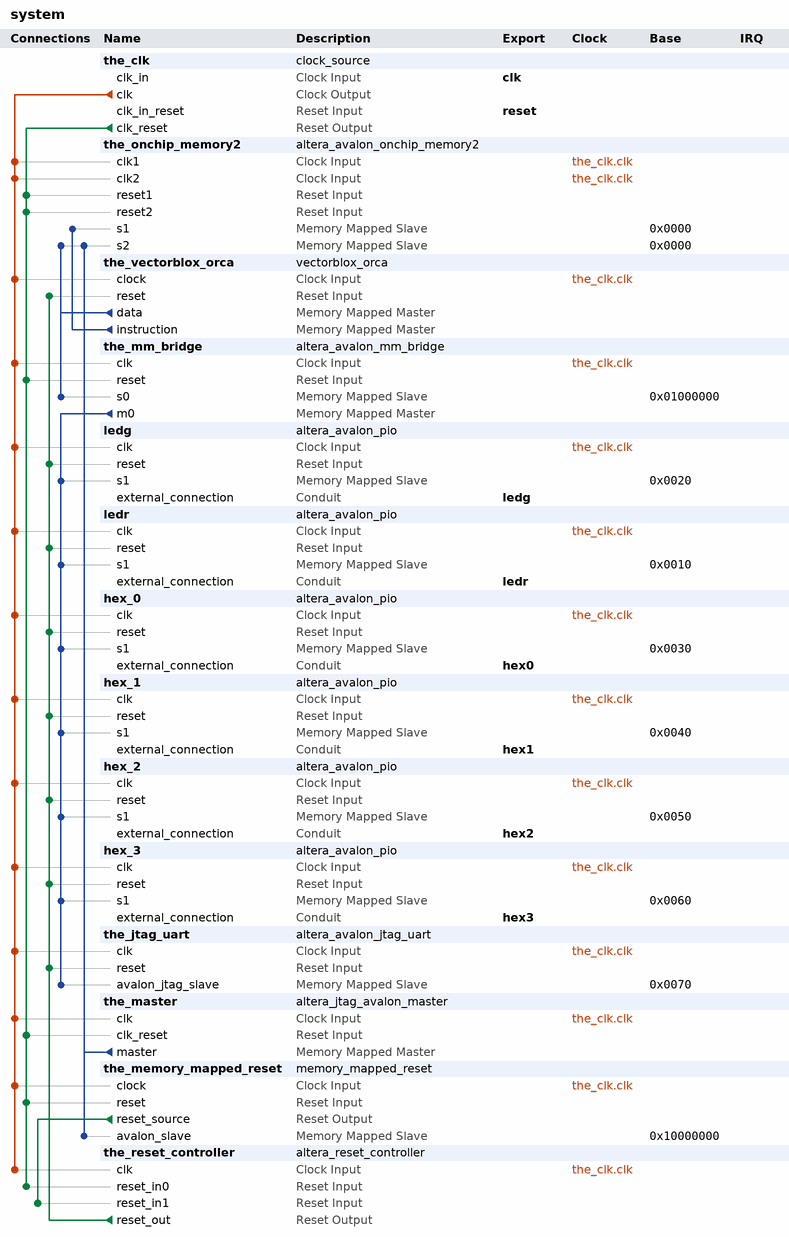
[diagram p0: system contents]
# Platform Designer (Qsys) system system, Cyclone IV E EP4CE115F29C7
# Parameters at their usual value, and those the tool derives, are not listed.
package require -exact qsys 15.1
create_system system
set_project_property DEVICE_FAMILY {Cyclone IV E}
set_project_property DEVICE EP4CE115F29C7

add_instance the_clk clock_source 15.1
set_instance_parameter_value the_clk clockFrequency 50000000

add_instance the_onchip_memory2 altera_avalon_onchip_memory2 15.1
set_instance_parameter_value the_onchip_memory2 dataWidth 32
set_instance_parameter_value the_onchip_memory2 dualPort true
set_instance_parameter_value the_onchip_memory2 initMemContent true
set_instance_parameter_value the_onchip_memory2 initializationFileName test.hex
set_instance_parameter_value the_onchip_memory2 memorySize 65536
set_instance_parameter_value the_onchip_memory2 useNonDefaultInitFile true

add_instance the_vectorblox_orca vectorblox_orca 1.0
set_instance_parameter_value the_vectorblox_orca BRANCH_PREDICTION false
set_instance_parameter_value the_vectorblox_orca BTB_SIZE 0
set_instance_parameter_value the_vectorblox_orca BUS_TYPE Avalon
set_instance_parameter_value the_vectorblox_orca COUNTER_LENGTH 64
set_instance_parameter_value the_vectorblox_orca DATA_REQUEST_REGISTER 0
set_instance_parameter_value the_vectorblox_orca DATA_RETURN_REGISTER 0
set_instance_parameter_value the_vectorblox_orca DIVIDE_ENABLE 1
set_instance_parameter_value the_vectorblox_orca ENABLE_EXCEPTIONS 1
set_instance_parameter_value the_vectorblox_orca ENABLE_EXT_INTERRUPTS 1
set_instance_parameter_value the_vectorblox_orca EXT_INTERRUPTS 1
set_instance_parameter_value the_vectorblox_orca FAMILY ALTERA
set_instance_parameter_value the_vectorblox_orca ICACHE_BURST_EN 0
set_instance_parameter_value the_vectorblox_orca ICACHE_EXTERNAL_WIDTH 32
set_instance_parameter_value the_vectorblox_orca ICACHE_LINE_SIZE 32
set_instance_parameter_value the_vectorblox_orca ICACHE_SIZE 0
set_instance_parameter_value the_vectorblox_orca INTERRUPT_VECTOR 512
set_instance_parameter_value the_vectorblox_orca IUC_ADDR_BASE 0
set_instance_parameter_value the_vectorblox_orca IUC_ADDR_LAST 0
set_instance_parameter_value the_vectorblox_orca LVE_ENABLE 0
set_instance_parameter_value the_vectorblox_orca MULTIPLY_ENABLE 1
set_instance_parameter_value the_vectorblox_orca PIPELINE_STAGES 5
set_instance_parameter_value the_vectorblox_orca POWER_OPTIMIZED 0
set_instance_parameter_value the_vectorblox_orca REGISTER_SIZE 32
set_instance_parameter_value the_vectorblox_orca RESET_VECTOR 0
set_instance_parameter_value the_vectorblox_orca SCRATCHPAD_SIZE 64
set_instance_parameter_value the_vectorblox_orca SHIFTER_MAX_CYCLES 1

add_instance the_mm_bridge altera_avalon_mm_bridge 15.1
set_instance_parameter_value the_mm_bridge ADDRESS_UNITS SYMBOLS
set_instance_parameter_value the_mm_bridge ADDRESS_WIDTH 11
set_instance_parameter_value the_mm_bridge DATA_WIDTH 32
set_instance_parameter_value the_mm_bridge MAX_PENDING_RESPONSES 1
set_instance_parameter_value the_mm_bridge PIPELINE_COMMAND 0
set_instance_parameter_value the_mm_bridge PIPELINE_RESPONSE 0
set_instance_parameter_value the_mm_bridge USE_AUTO_ADDRESS_WIDTH 1

add_instance ledg altera_avalon_pio 15.1
set_instance_parameter_value ledg direction Output
set_instance_parameter_value ledg width 32

add_instance ledr altera_avalon_pio 15.1
set_instance_parameter_value ledr direction Output
set_instance_parameter_value ledr width 32

add_instance hex_0 altera_avalon_pio 15.1
set_instance_parameter_value hex_0 direction Output
set_instance_parameter_value hex_0 width 32

add_instance hex_1 altera_avalon_pio 15.1
set_instance_parameter_value hex_1 direction Output
set_instance_parameter_value hex_1 width 32

add_instance hex_2 altera_avalon_pio 15.1
set_instance_parameter_value hex_2 direction Output
set_instance_parameter_value hex_2 width 32

add_instance hex_3 altera_avalon_pio 15.1
set_instance_parameter_value hex_3 direction Output
set_instance_parameter_value hex_3 width 32

add_instance the_jtag_uart altera_avalon_jtag_uart 15.1
set_instance_parameter_value the_jtag_uart simInteractiveOptions NO_INTERACTIVE_WINDOWS

add_instance the_master altera_jtag_avalon_master 15.1

add_instance the_memory_mapped_reset memory_mapped_reset 1.0
set_instance_parameter_value the_memory_mapped_reset ADDR_WIDTH 2
set_instance_parameter_value the_memory_mapped_reset REGISTER_SIZE 32

add_instance the_reset_controller altera_reset_controller 15.1
set_instance_parameter_value the_reset_controller NUM_RESET_INPUTS 2
set_instance_parameter_value the_reset_controller SYNC_DEPTH 2

# connections
add_connection the_clk.clk hex_0.clk clock
add_connection the_clk.clk hex_1.clk clock
add_connection the_clk.clk hex_2.clk clock
add_connection the_clk.clk hex_3.clk clock
add_connection the_clk.clk ledg.clk clock
add_connection the_clk.clk ledr.clk clock
add_connection the_clk.clk the_jtag_uart.clk clock
add_connection the_clk.clk the_master.clk clock
add_connection the_clk.clk the_memory_mapped_reset.clock clock
add_connection the_clk.clk the_mm_bridge.clk clock
add_connection the_clk.clk the_onchip_memory2.clk1 clock
add_connection the_clk.clk the_onchip_memory2.clk2 clock
add_connection the_clk.clk the_reset_controller.clk clock
add_connection the_clk.clk the_vectorblox_orca.clock clock
add_connection the_clk.clk_reset the_master.clk_reset reset
add_connection the_clk.clk_reset the_memory_mapped_reset.reset reset
add_connection the_clk.clk_reset the_mm_bridge.reset reset
add_connection the_clk.clk_reset the_onchip_memory2.reset1 reset
add_connection the_clk.clk_reset the_onchip_memory2.reset2 reset
add_connection the_clk.clk_reset the_reset_controller.reset_in0 reset
add_connection the_memory_mapped_reset.reset_source the_reset_controller.reset_in1 reset
add_connection the_reset_controller.reset_out hex_0.reset reset
add_connection the_reset_controller.reset_out hex_1.reset reset
add_connection the_reset_controller.reset_out hex_2.reset reset
add_connection the_reset_controller.reset_out hex_3.reset reset
add_connection the_reset_controller.reset_out ledg.reset reset
add_connection the_reset_controller.reset_out ledr.reset reset
add_connection the_reset_controller.reset_out the_jtag_uart.reset reset
add_connection the_reset_controller.reset_out the_vectorblox_orca.reset reset
add_connection the_master.master the_memory_mapped_reset.avalon_slave avalon
set_connection_parameter_value the_master.master/the_memory_mapped_reset.avalon_slave baseAddress 0x10000000
add_connection the_master.master the_onchip_memory2.s2 avalon
set_connection_parameter_value the_master.master/the_onchip_memory2.s2 baseAddress 0x0000
add_connection the_mm_bridge.m0 hex_0.s1 avalon
set_connection_parameter_value the_mm_bridge.m0/hex_0.s1 baseAddress 0x0030
add_connection the_mm_bridge.m0 hex_1.s1 avalon
set_connection_parameter_value the_mm_bridge.m0/hex_1.s1 baseAddress 0x0040
add_connection the_mm_bridge.m0 hex_2.s1 avalon
set_connection_parameter_value the_mm_bridge.m0/hex_2.s1 baseAddress 0x0050
add_connection the_mm_bridge.m0 hex_3.s1 avalon
set_connection_parameter_value the_mm_bridge.m0/hex_3.s1 baseAddress 0x0060
add_connection the_mm_bridge.m0 ledg.s1 avalon
set_connection_parameter_value the_mm_bridge.m0/ledg.s1 baseAddress 0x0020
add_connection the_mm_bridge.m0 ledr.s1 avalon
set_connection_parameter_value the_mm_bridge.m0/ledr.s1 baseAddress 0x0010
add_connection the_mm_bridge.m0 the_jtag_uart.avalon_jtag_slave avalon
set_connection_parameter_value the_mm_bridge.m0/the_jtag_uart.avalon_jtag_slave baseAddress 0x0070
add_connection the_vectorblox_orca.data the_mm_bridge.s0 avalon
set_connection_parameter_value the_vectorblox_orca.data/the_mm_bridge.s0 baseAddress 0x01000000
add_connection the_vectorblox_orca.data the_onchip_memory2.s2 avalon
set_connection_parameter_value the_vectorblox_orca.data/the_onchip_memory2.s2 baseAddress 0x0000
add_connection the_vectorblox_orca.instruction the_onchip_memory2.s1 avalon
set_connection_parameter_value the_vectorblox_orca.instruction/the_onchip_memory2.s1 baseAddress 0x0000

# exported interfaces
add_interface clk clock sink
set_interface_property clk EXPORT_OF the_clk.clk_in
add_interface hex0 conduit end
set_interface_property hex0 EXPORT_OF hex_0.external_connection
add_interface hex1 conduit end
set_interface_property hex1 EXPORT_OF hex_1.external_connection
add_interface hex2 conduit end
set_interface_property hex2 EXPORT_OF hex_2.external_connection
add_interface hex3 conduit end
set_interface_property hex3 EXPORT_OF hex_3.external_connection
add_interface ledg conduit end
set_interface_property ledg EXPORT_OF ledg.external_connection
add_interface ledr conduit end
set_interface_property ledr EXPORT_OF ledr.external_connection
add_interface reset reset sink
set_interface_property reset EXPORT_OF the_clk.clk_in_reset

set_interconnect_requirement {$system} qsys_mm.clockCrossingAdapter HANDSHAKE
set_interconnect_requirement {$system} qsys_mm.insertDefaultSlave FALSE
set_interconnect_requirement {$system} qsys_mm.maxAdditionalLatency 1

save_system system.qsys
